# EAGLE design Xtend-devboard (EAGLE 6.3)
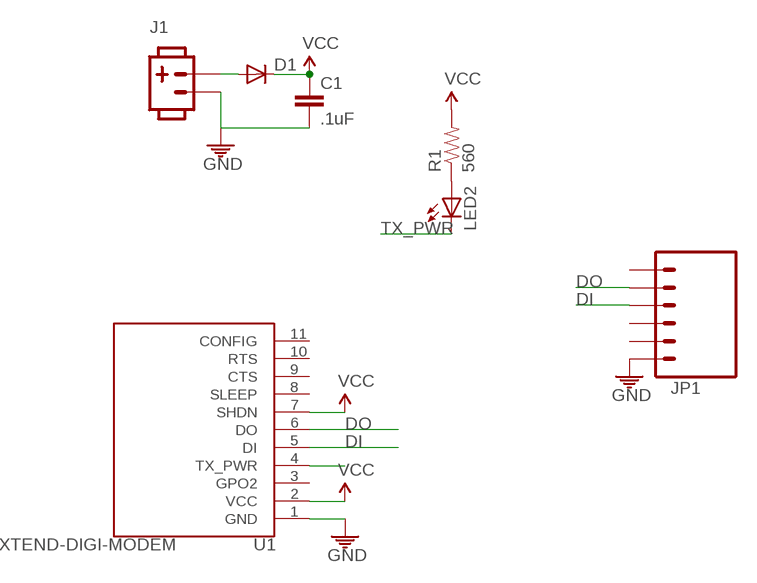
[diagram p0: schematic, sheet 1]

## Parts
C1  .1uF  CAPPTH1  [CAP-PTH-5MM]
D1  DIODE1N4148  [DIODE-1N4148]
J1  POW_CONNECTMALE  [SOCKET-MALE-3.96MM-2]
JP1  M06LOCK  [1X06_LOCK]
LED2  LED5MM  [LED5MM]
R1  560  RESISTORAXIAL-0.3  [AXIAL-0.3]
U1  XTEND-DIGI-MODEM  [XTEND-DIGI-MODEM]

## Nets
DI: JP1.4 U1.5(DI)
DO: JP1.5 U1.6(DO)
GND: C1.2 J1.P$2 JP1.1 U1.1(GND)
N$1: D1.A J1.P$1
N$2: LED2.A R1.P$1
TX_PWR: LED2.K(C) U1.4(TX_PWR)
VCC: C1.1 D1.C R1.P$2 U1.2(VCC) U1.7(SHDN)
Unconnected: JP1.2 JP1.3 JP1.6 U1.3(GPO2) U1.8(SLEEP) U1.9(CTS) U1.10(RTS) U1.11(CONFIG)

## Library data of the parts
C1 = ASL:CAP: Capacitor Standard 0603 ceramic capacitor, and 0.1" leaded capacitor.
D1 = ASL:DIODE: Diode These are standard reverse protection diodes and small signal diodes. SMA package can handle up to about 1A. SOD-323 can handle about 200mA. What the SOD-323 package when ordering, there are some mfgs out there that are 5-pin packages.
J1 = ASL:POW_CONNECT
JP1 = ASL:M06: Header 6 Standard 6-pin 0.1" header. Use with straight break away headers (SKU : PRT-00116), right angle break away headers (PRT-00553), swiss pins (PRT-00743), machine pins (PRT-00117), and female headers (PRT-00115). Molex polarized connector foot print use with SKU : PRT-08094 with associated crimp pins and housings. NOTES ON THE VARIANTS LOCK and LOCK_LONGPADS... This footprint was designed to help hold the alignment of a through-hole component (i.e. 6-pin header) while soldering it into place. You may notice that each hole has been shifted either up or down by 0.005 of an inch from it's more standard position (which is a perfectly straight line). This slight alteration caused the pins (the squares in the middle) to touch the edges of the holes. Because they are alternating, it causes a "brace" to hold the component in place. 0.005 has proven to be the perfect amount of "off-center" position when using our standard breakaway headers. Although looks a little odd when you look at the bare footprint, once you have a header in there, the alteration is very hard to notice. Also, if you push a header all the way into place, it is covered up entirely on the bottom side. This idea of altering the position of holes to aid alignment will be further integrated into the Sparkfun Library for other footprints. It can help hold any component with 3 or more connection pins.
LED2 = ASL:LED: LEDs Standard schematic elements and footprints for 5mm, 3mm, 1206, and 0603 sized LEDs. 5mm - Spark Fun Electronics SKU : COM-00529 (and others)
R1 = ASL:RESISTOR: Resistor Basic schematic elements and footprints for 0603, 1206, and PTH resistors.
U1 = ASL:XTEND-DIGI-MODEM: Xtend Digi Modem WRL-09411

## Board
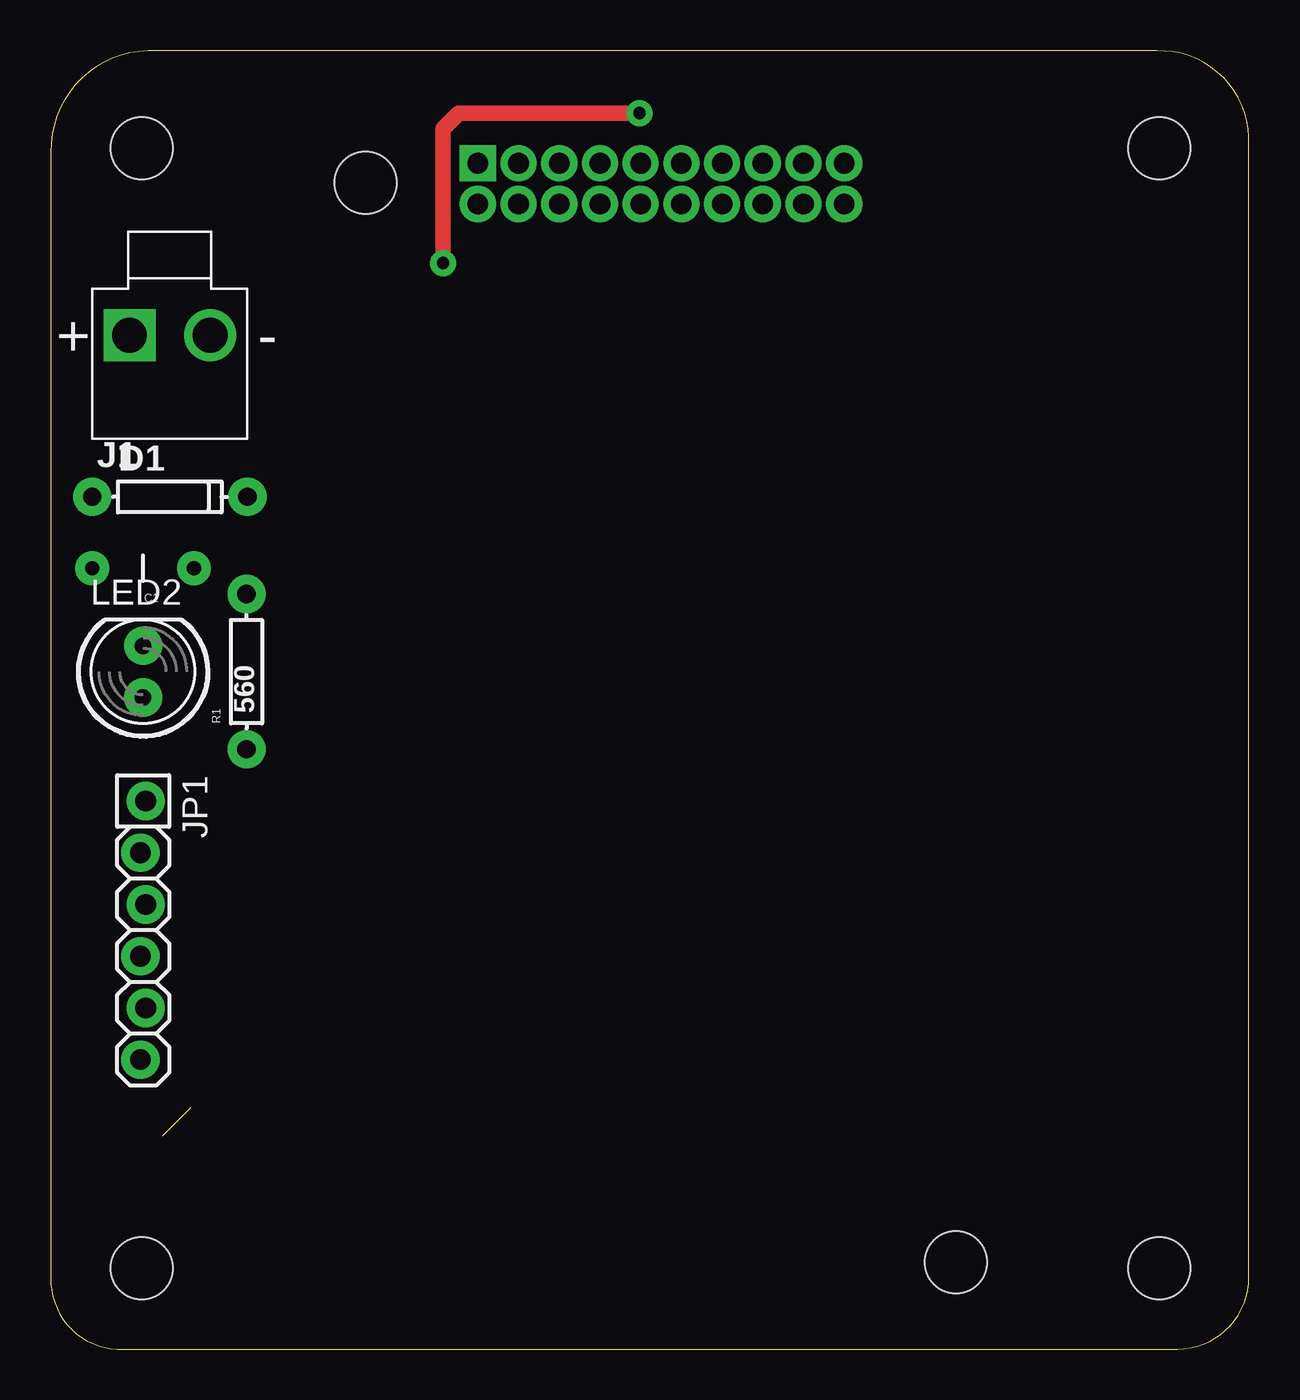
[diagram p1: board, top side]
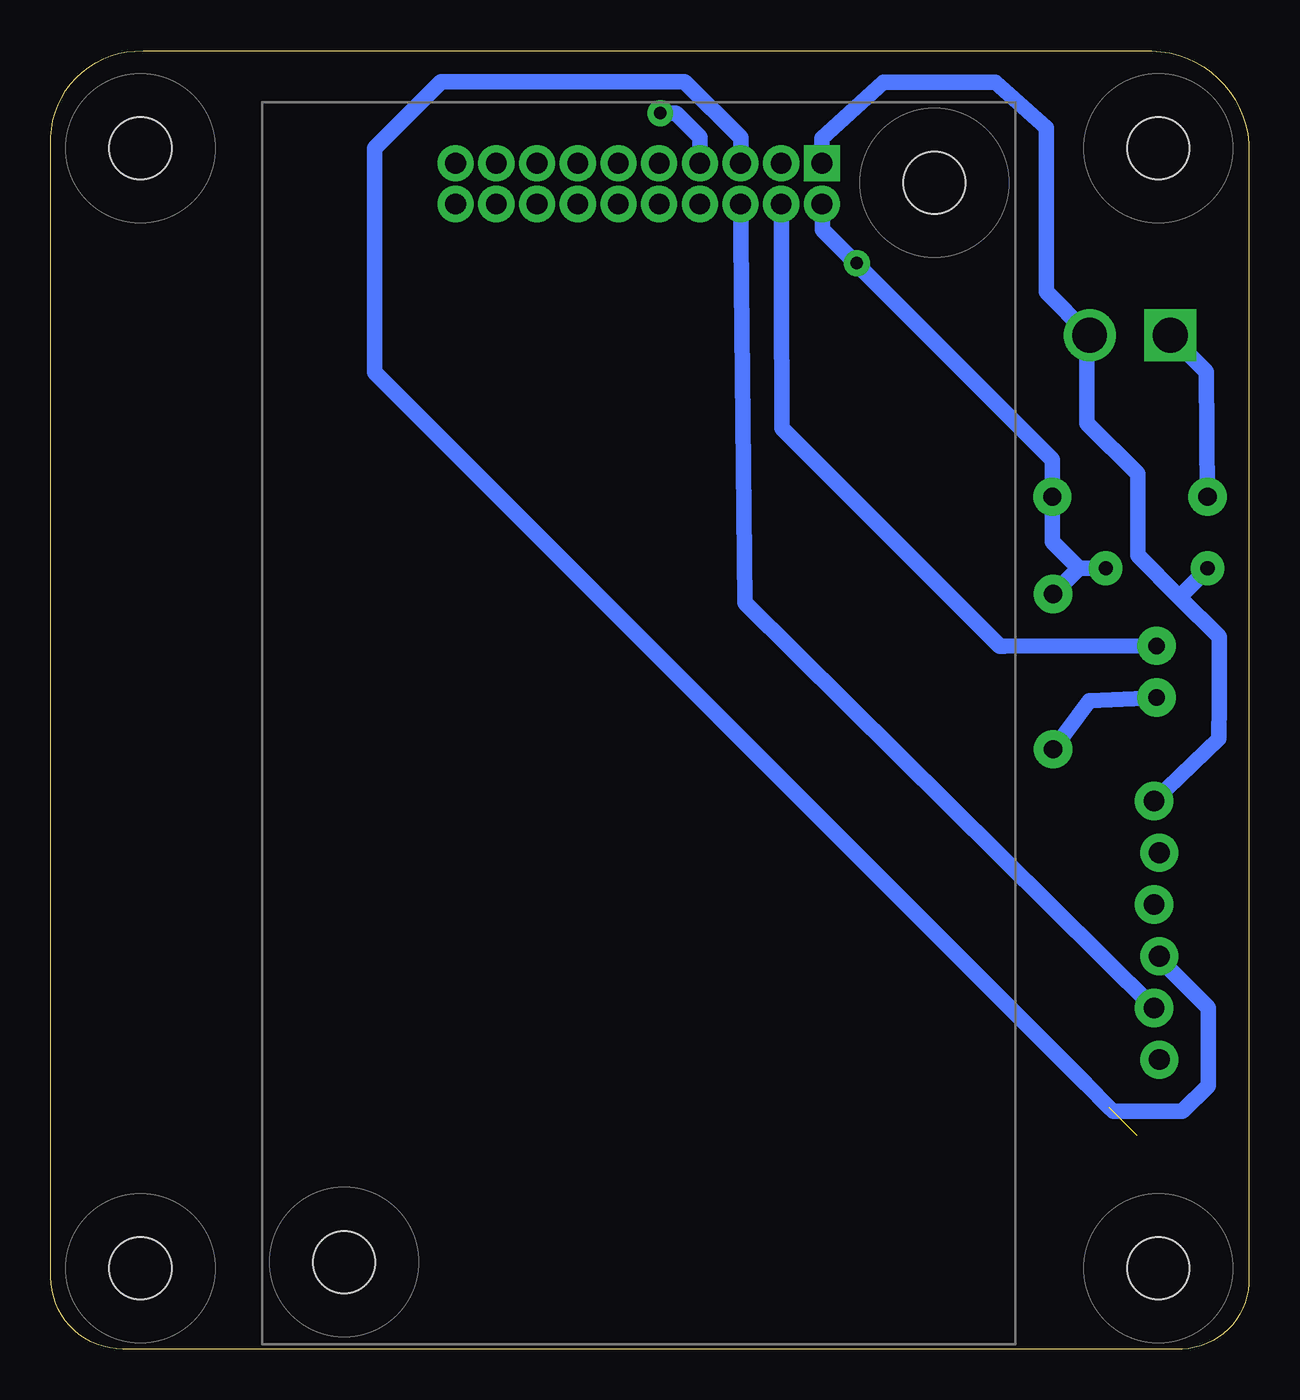
[diagram p2: board, bottom side, seen from below]

Size 58.85 x 63.75 mm. Coordinates in mm from the lower left corner, seen from the top.
Outline: 0,58.77 0,3.52 arc90 3.27,0 55.32,0 arc90 58.85,3.53 58.85,59.52 arc90 54.32,63.75 4.77,63.75 arc90 0,58.77
Copper layers (1*16): Top 0.035mm / dielectric 1.5mm / Bottom 0.035mm
Design rules "default": minimum track width 10mil, minimum drill 24mil, track to track 8mil, track to pad 8mil, pad to pad 8mil, via to via 8mil, smd to smd 8mil, copper to edge 40mil, drill to drill 8mil, minimum pad ring 10mil, minimum via ring 8mil, stop-mask expansion 4mil, vias tented up to drill 0mil, thermal gap 10mil

### Footprints (pad centres in the part's own frame; a part is rotated, then mirrored left to right if it is on the bottom)
CAP-PTH-5MM = drill 0.7 pad 1.651: 1 -2.5,0; 2 2.5,0
DIODE-1N4148 = drill 0.9 pad 1.88: A -3.81,0; C 3.81,0
SOCKET-MALE-3.96MM-2 = drill 1.7 square: P$1 -1.98,0 | drill 1.7: P$2 1.98,0
1X06_LOCK = drill 1.016 pad 1.88: 1 0,0.127; 2 2.54,-0.127; 3 5.08,0.127; 4 7.62,-0.127; 5 10.16,0.127; 6 12.7,-0.127
LED5MM = drill 0.813 pad 1.88: A -1.27,0; K 1.27,0
AXIAL-0.3 = drill 0.9 pad 1.88: P$1 -3.81,0; P$2 3.81,0
XTEND-DIGI-MODEM = drill 1.016 pad 1.778 square: 1 -9,-27.5 | drill 1.016 pad 1.778: 2 -9,-25.5; 3 -7,-27.5; 4 -7,-25.5; 5 -5,-27.5; 6 -5,-25.5; 7 -3,-27.5; 8 -3,-25.5; 9 -1,-27.5; 10 -1,-25.5; 11 1,-27.5; 12 1,-25.5; 13 3,-27.5; 14 3,-25.5; 15 5,-27.5; 16 5,-25.5; 17 7,-27.5; 18 7,-25.5; 19 9,-27.5; 20 9,-25.5
STAND-OFF-TIGHT = hole 3.048: 0,0

### Placement (x,y rotation side)
C1  4.53,38.34 180 top
D1  5.84,41.85 0 top
J1  5.84,49.78 0 top
JP1  4.53,26.91 270 top
LED2  4.53,33.26 90 top
R1  9.61,33.26 90 top
U1  29.97,30.73 180 bottom
U$2  [STAND-OFF-TIGHT]  15.45,57.27 0 top
U$3  [STAND-OFF-TIGHT]  44.45,4.27 0 top
U$4  [STAND-OFF-TIGHT]  54.45,3.97 0 top
U$5  [STAND-OFF-TIGHT]  4.45,3.97 0 top
U$6  [STAND-OFF-TIGHT]  54.45,58.97 0 top
U$7  [STAND-OFF-TIGHT]  4.45,58.97 0 top

### Tracks (layer width: path | path; a pad name or v marks a point on that pad's centre or on a via)
DI  (1 unrouted)
  Bottom 0.762: U1.5 24.95,58.25 24.95,59.47 27.72,62.24 39.68,62.24 42.95,58.97 42.95,47.97 7.99,13.01 6.88,11.88 6.67,11.67 3.26,11.67 1.99,12.94 1.99,16.75 4.41,19.17 JP1.4
DO
  Bottom 0.762: JP1.5 24.76,36.64 24.95,54.47 24.95,56.21 U1.6
GND
  Bottom 0.762: U1.1 20.97,59.45 17.95,62.22 12.45,62.22 9.95,59.97 9.95,51.91 7.95,49.91 | 7.95,49.91 J1.P$2 | JP1.1 1.48,29.96 1.46,31.74 1.46,34.98 3.41,36.93 | 3.41,36.93 5.45,38.97 5.45,42.97 7.95,45.47 7.95,49.91 | C1.2 2.03,38.3 3.41,36.93
N$1
  Bottom 0.762: J1.P$1 2.08,48 D1.A
N$2
  Bottom 0.762: R1.P$1 7.84,31.84 LED2.A
TX_PWR
  Bottom 0.762: LED2.K 12.01,34.52 12.23,34.52 22.94,45.22 22.95,51.97 22.95,56.21 U1.4
VCC  (via drill 0.6 pad 1.27)
  Top 0.762: v28.92,60.7 20.03,60.7 19.26,59.93 v19.26,53.33
  Bottom 0.762: 19.67,53.69 9.65,43.67 D1.C 9.65,39.65 8.34,38.34 | 19.67,53.69 20.95,54.97 20.95,56.21 U1.2 | U1.7 26.97,59.51 28.15,60.7 v28.92,60.7 | v19.26,53.33 19.67,53.69 | C1.1 8.34,38.34 | 8.34,38.34 R1.P$2